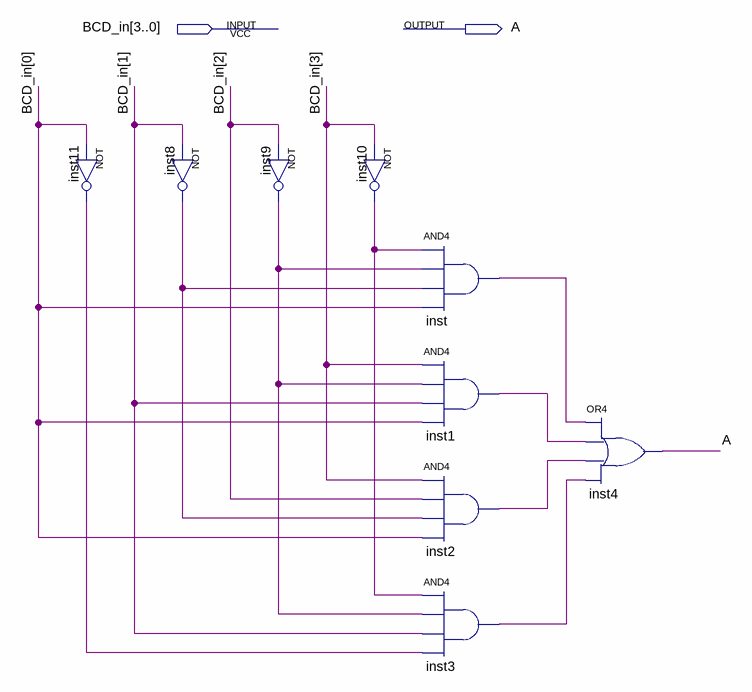
[diagram p0: schematic sheet]
// Quartus schematic A.bdf as structural Verilog: 9 symbols, 2 pins
module A (
  input  [3:0] BCD_in,
  output A
);

  wire inst1_out, inst2_out, inst3_out, inst8_out, inst9_out, inst10_out, inst11_out, inst_out;

  not inst11 (inst11_out, BCD_in[0]);
  not inst8 (inst8_out, BCD_in[1]);
  not inst9 (inst9_out, BCD_in[2]);
  not inst10 (inst10_out, BCD_in[3]);
  and inst (inst_out, inst10_out, inst9_out, inst8_out, BCD_in[0]);
  and inst1 (inst1_out, BCD_in[3], inst9_out, BCD_in[1], BCD_in[0]);
  and inst2 (inst2_out, BCD_in[3], BCD_in[2], inst8_out, BCD_in[0]);
  and inst3 (inst3_out, inst10_out, inst9_out, BCD_in[1], inst11_out);
  or inst4 (A, inst_out, inst1_out, inst2_out, inst3_out);
endmodule
